# EasyEDA Pro project KOBE_FOC.epro, schematic KOBE_Doc_2
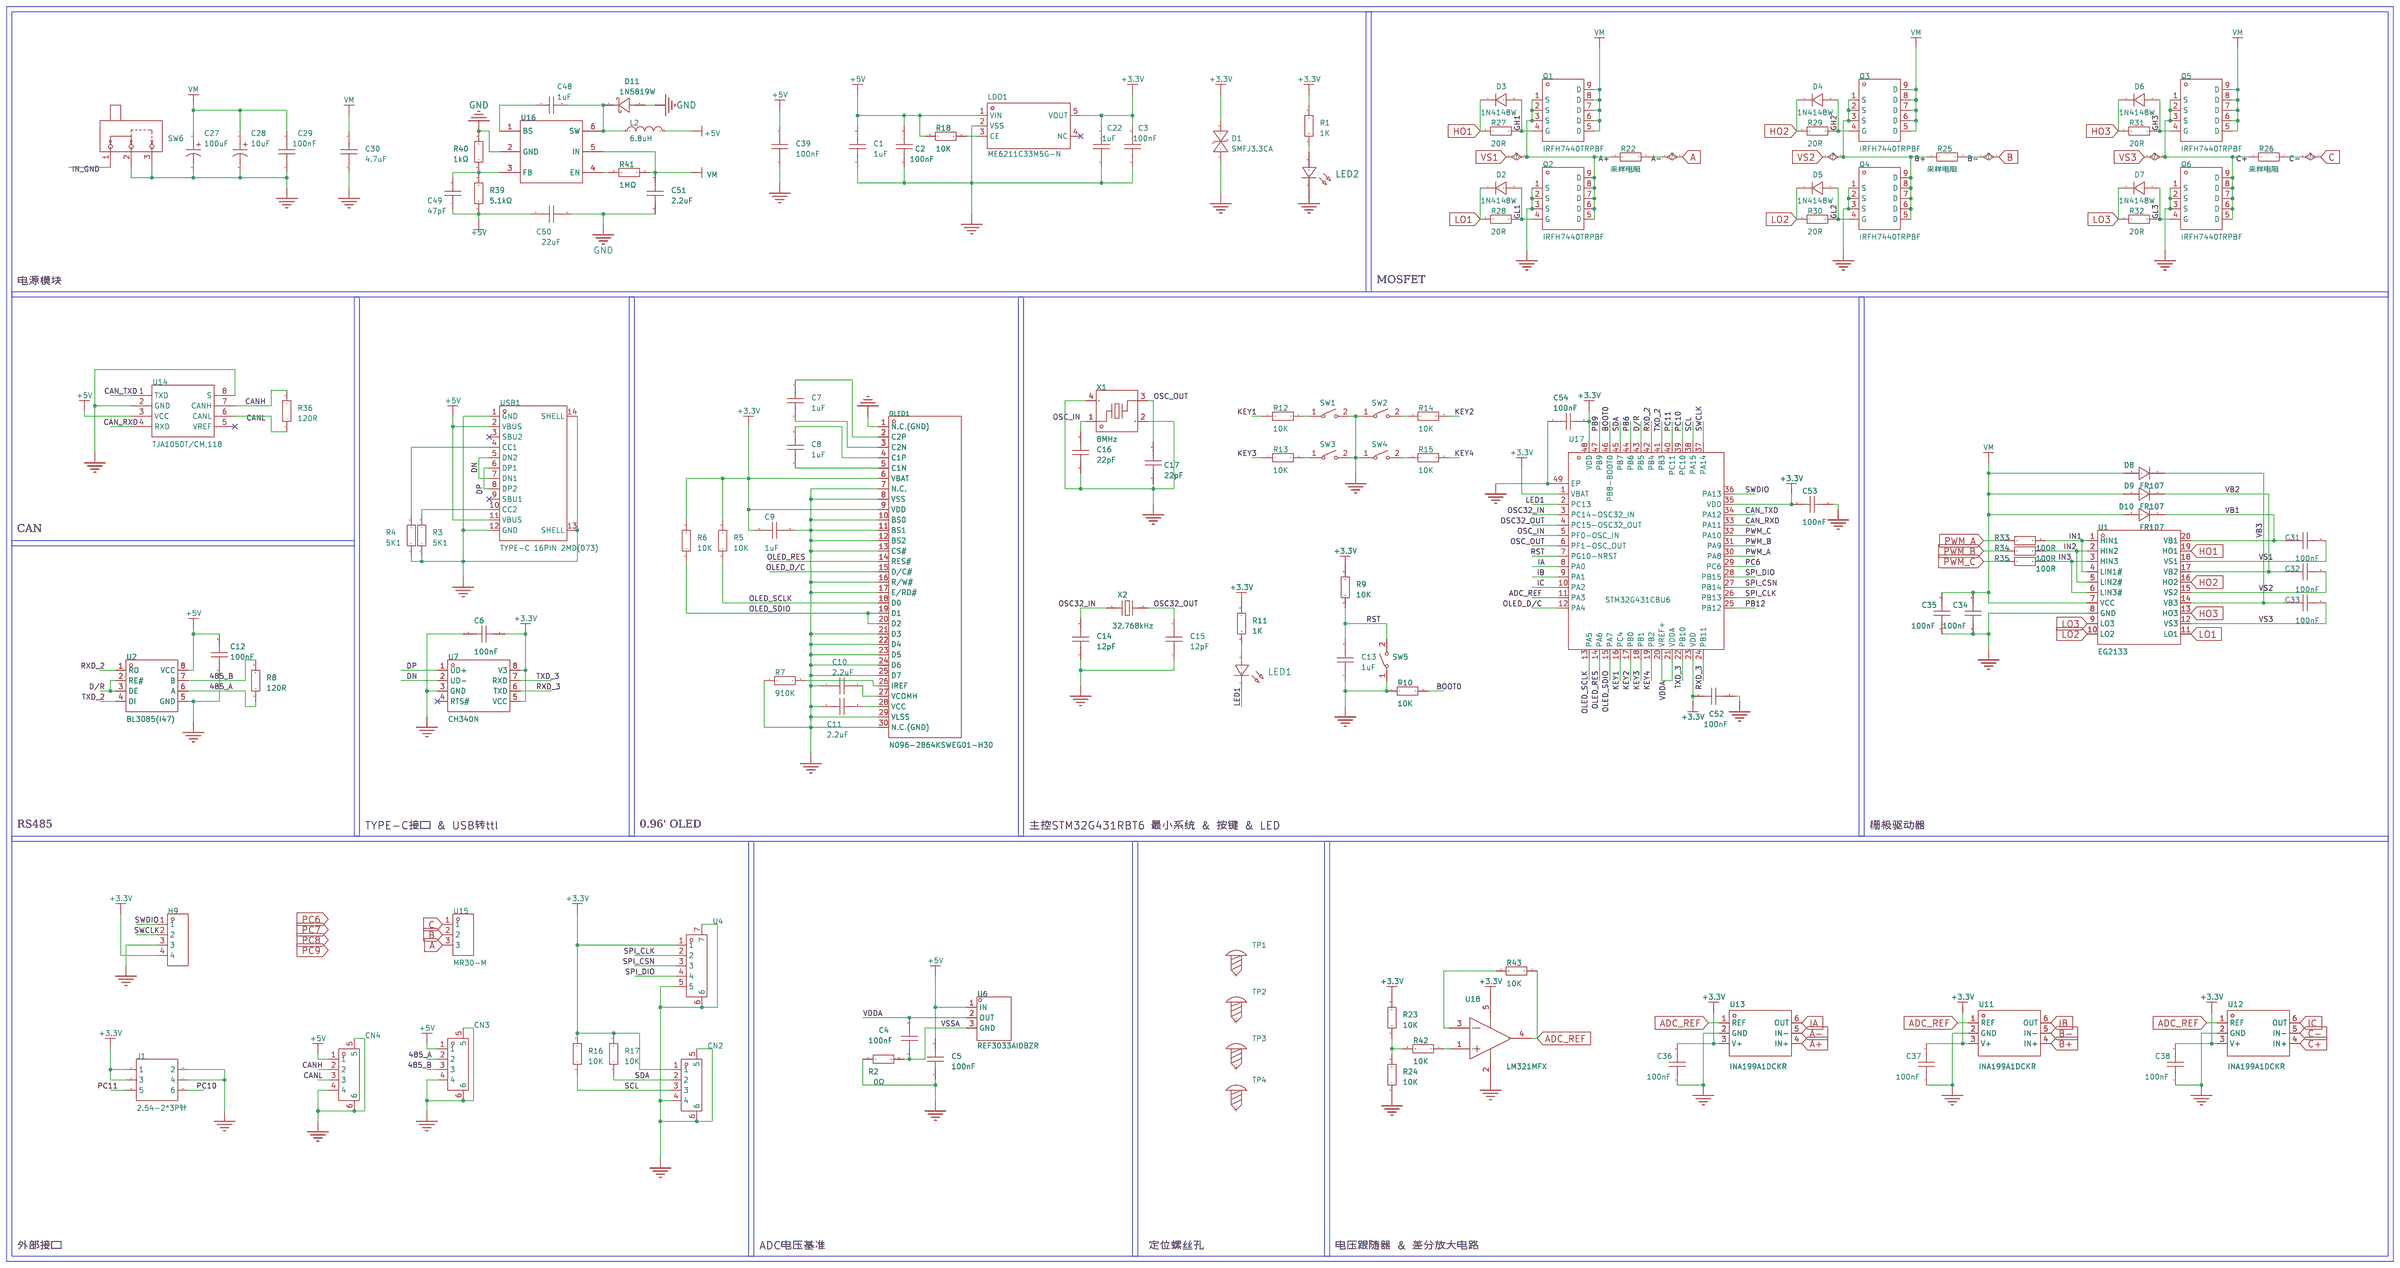
[diagram p0: schematic sheet]

## Parts
C1  1uF  [C0603]
C2  100nF  [C0603]
C3  100nF  [C0603]
C4  100nF  [C0603]
C5  100nF  [C0603]
C6  100nF  [C0603]
C7  1uF  [C0603]
C8  1uF  [C0603]
C9  1uF  [C0603]
C10  2.2uF  [C0603]
C11  2.2uF  [C0603]
C12  100nF  [C0603]
C13  1uF  [C0603]
C14  12pF  [C0603]
C15  12pF  [C0603]
C16  22pF  [C0603]
C17  22pF  [C0603]
C22  1uF  [C0603]
C27  100uF  [CAP-SMD_BD6.3-L6.6-W6.6-LS7.2-FD]
C28  10uF  [CAP-SMD_BD4.0-L4.3-W4.3-LS5.0-FD]
C29  100nF  [C0603]
C30  4.7uF  [C0603]
C31  100nF  [C0603]
C32  100nF  [C0603]
C33  100nF  [C0603]
C34  100nF  [C0603]
C35  100nF  [C0603]
C36  100nF  [C0603]
C37  100nF  [C0603]
C38  100nF  [C0603]
C39  100nF  [C0603]
C48  1uF  [C0603]
C49  47pF  [C0603]
C50  22uF  [C0603]
C51  2.2uF  [C0603]
C52  100nF  [C0603]
C53  100nF  [C0603]
C54  100nF  [C0603]
CN2  WAFER-SH1.0-4PWB  [CONN-SMD_4P-P1.00_WAFER-SH1.0-4PWB]
CN3  WAFER-SH1.0-4PWB  [CONN-SMD_4P-P1.00_WAFER-SH1.0-4PWB]
CN4  WAFER-SH1.0-4PWB  [CONN-SMD_4P-P1.00_WAFER-SH1.0-4PWB]
D1  SMFJ3.3CA  [SOD-123_L2.7-W1.6-LS3.7-BI]
D2  1N4148W  [SOD-123_L2.8-W1.8-LS3.7-RD]
D3  1N4148W  [SOD-123_L2.8-W1.8-LS3.7-RD]
D4  1N4148W  [SOD-123_L2.8-W1.8-LS3.7-RD]
D5  1N4148W  [SOD-123_L2.8-W1.8-LS3.7-RD]
D6  1N4148W  [SOD-123_L2.8-W1.8-LS3.7-RD]
D7  1N4148W  [SOD-123_L2.8-W1.8-LS3.7-RD]
D8  FR107  [SOD-123_L2.8-W1.8-LS3.7-RD]
D9  FR107  [SOD-123_L2.8-W1.8-LS3.7-RD]
D10  FR107  [SOD-123_L2.8-W1.8-LS3.7-RD]
D11  1N5819W  [SOD-123_L2.7-W1.6-LS3.7-RD-1]
H9  PZ254V-11-04P  [HDR-TH_4P-P2.54-V-M]
J1  2.54-2*3P针  [HDR-TH_6P-P2.54-V-M-R2-C3-S2.54-1]
L2  6.8uH  [IND-SMD_L4.4-W4.2]
LDO1  ME6211C33M5G-N  [SOT-23-5_L3.0-W1.7-P0.95-LS2.8-BL]
LED1  -  [LED_0603]
LED2  -  [LED_0603]
OLED1  N096-2864KSWEG01-H30  [OLED_0.96-30P-P0.70-12864]
Q1  IRFH7440TRPBF  [DFN-8_L5.8-W4.9-P1.27-LS6.0-BL-1]
Q2  IRFH7440TRPBF  [DFN-8_L5.8-W4.9-P1.27-LS6.0-BL-1]
Q3  IRFH7440TRPBF  [DFN-8_L5.8-W4.9-P1.27-LS6.0-BL-1]
Q4  IRFH7440TRPBF  [DFN-8_L5.8-W4.9-P1.27-LS6.0-BL-1]
Q5  IRFH7440TRPBF  [DFN-8_L5.8-W4.9-P1.27-LS6.0-BL-1]
Q6  IRFH7440TRPBF  [DFN-8_L5.8-W4.9-P1.27-LS6.0-BL-1]
R1  1K  [R0603]
R2  0Ω  [R0603]
R3  5K1  [R0603]
R4  5K1  [R0603]
R5  10K  [R0603]
R6  10K  [R0603]
R7  910K  [R0603]
R8  120R  [R0603]
R9  10K  [R0603]
R10  10K  [R0603]
R11  1K  [R0603]
R12  10K  [R0603]
R13  10K  [R0603]
R14  10K  [R0603]
R15  10K  [R0603]
R16  10K  [R0603]
R17  10K  [R0603]
R18  10K  [R0603]
R22  采样电阻  [R1206]
R23  10K  [R0603]
R24  10K  [R0603]
R25  采样电阻  [R1206]
R26  采样电阻  [R1206]
R27  20R  [R0603]
R28  20R  [R0603]
R29  20R  [R0603]
R30  20R  [R0603]
R31  20R  [R0603]
R32  20R  [R0603]
R33  100R  [R0603]
R34  100R  [R0603]
R35  100R  [R0603]
R36  120R  [R0603]
R39  5.1kΩ  [R0603]
R40  1kΩ  [R0603]
R41  1MΩ  [R0603]
R42  10K  [R0603]
R43  10K  [R0603]
SW1  TS-1088R-02026  [SW-SMD_L3.9-W3.0-P4.45]
SW2  TS-1088R-02026  [SW-SMD_L3.9-W3.0-P4.45]
SW3  TS-1088R-02026  [SW-SMD_L3.9-W3.0-P4.45]
SW4  TS-1088R-02026  [SW-SMD_L3.9-W3.0-P4.45]
SW5  TS-1088R-02026  [SW-SMD_L3.9-W3.0-P4.45]
SW6  KH-SS12D01-G3-5.0  [SW-TH_KH-SS12D01-G3-5.0]
TP1  -  [M2螺丝]
TP2  -  [M2螺丝]
TP3  -  [M2螺丝]
TP4  -  [M2螺丝]
U1  EG2133  [TSSOP-20_L6.5-W4.4-P0.65-LS6.4-BL]
U2  BL3085(I47)  [SOP-8_L4.9-W3.9-P1.27-LS6.0-BL]
U4  WAFER-SH1.0-5PWB  [CONN-SMD_5P-P1.00_XUNPU_WAFER-SH1.0-5PWB]
U6  REF3033AIDBZR  [SOT-23-3_L3.0-W1.7-P0.95-LS2.9-BR]
U7  CH340N  [SOP-8_L4.9-W3.9-P1.27-LS6.0-BL]
U11  INA199A1DCKR  [SC-70-6_L2.2-W1.3-P0.65-LS2.1-BR]
U12  INA199A1DCKR  [SC-70-6_L2.2-W1.3-P0.65-LS2.1-BR]
U13  INA199A1DCKR  [SC-70-6_L2.2-W1.3-P0.65-LS2.1-BR]
U14  TJA1050T/CM,118  [SOIC-8_L5.0-W4.0-P1.27-LS6.0-BL]
U15  MR30-M  [CONN-TH_MR30-M]
U16  ME3116AM6G  [SOT-23-6_L2.9-W1.6-P0.95-LS2.8-BL]
U17  STM32G431CBU6  [UFQFPN-48_L7.0-W7.0-P0.50-BL-EP]
U18  LM321MFX  [SOT-23-5_L2.9-W1.6-P0.95-LS2.8-BL]
USB1  TYPE-C 16PIN 2MD(073)  [USB-C-SMD_TYPE-C-6PIN-2MD-073]
X1  8MHz  [OSC-SMD_4P-L3.2-W2.5-BL]
X2  32.768kHz  [OSC-SMD_L3.2-W1.5]

## Library data of the parts
C1-C17 C22 C29-C39 C51-C54 = CAP_0603: Supplier Footprint: 0603
C27 = RVT100UF16V67RV0016: 容值:100uF;精度:±20%;额定电压:16V;纹波电流:93mA@120Hz;等效串联电阻:-;; LCSC Part Name: 100uF ±20% 16V; Supplier Part: C2887276; Manufacturer: KNSCHA(科尼盛); Supplier Footprint: SMD,D6.3xL5.4mm; JLCPCB Part Class: Extended Part; Datasheet: https://atta.szlcsc.com/upload/public/pdf/source/20210824/B97D2C1FD85DB1F31706138D89C4BE44.pdf; Supplier: LCSC; Tolerance: ±20%; Rated Voltage: 16V; Ripple Current: 93mA@120Hz; φD: 6.3mm; L: 5.4mm; Lifetime @ Temp: 2000hrs@105℃; Operating Temperature: -55℃~+105℃
C28 = VT10UF16V167RV0128: 容值:10uF;精度:±20%;额定电压:16V;纹波电流:18mA@120kHz;等效串联电阻:-;; LCSC Part Name: 10uF ±20% 16V; Supplier Part: C5246581; Manufacturer: KNSCHA(科尼盛); Supplier Footprint: SMD,D4xL5.4mm; JLCPCB Part Class: Extended Part; Datasheet: https://atta.szlcsc.com/upload/public/pdf/source/20221103/9F9BF07BB249386F3919A1DEC4ACBDCD.pdf; Supplier: LCSC; Tolerance: ±20%; Rated Voltage: 16V; Ripple Current: 18mA@120kHz; φD: 4mm; L: 5.4mm; Lifetime @ Temp: 2000hrs@105℃; Operating Temperature: -55℃~+105℃
C48 = 0603B103K500NT: 容值:10nF;精度:±10%;额定电压:50V;材质(温度系数):X7R;; LCSC Part Name: 10nF ±10% 50V; Supplier Part: C57112; Manufacturer: FH(风华); Supplier Footprint: 0603; JLCPCB Part Class: 基础库; Datasheet: https://atta.szlcsc.com/upload/public/pdf/source/20170923/C57112_1506149495135988846.pdf; Supplier: LCSC; Tolerance: ±10%; Voltage Rated: 50V; Temperature Coefficient: X7R
C49 = CL10C470JB8NNNC: 容值:47pF;精度:±5%;额定电压:50V;材质(温度系数):C0G;; LCSC Part Name: 47pF ±5% 50V; Supplier Part: C1671; Manufacturer: SAMSUNG(三星); Supplier Footprint: 0603; JLCPCB Part Class: 基础库; Datasheet: https://atta.szlcsc.com/upload/public/pdf/source/20160103/1457707689439.pdf; Supplier: LCSC; Tolerance: ±5%; Voltage Rated: 50V; Temperature Coefficient: C0G
C50 = CL10A226MQ8NRNC: 容值:22uF;精度:±20%;额定电压:6.3V;材质(温度系数):X5R;; LCSC Part Name: 22uF ±20% 6.3V; Supplier Part: C59461; Manufacturer: SAMSUNG(三星); Supplier Footprint: 0603; JLCPCB Part Class: 基础库; Datasheet: https://atta.szlcsc.com/upload/public/pdf/source/20160103/1457707740762.pdf; Supplier: LCSC; Tolerance: ±20%; Voltage Rated: 6.3V; Temperature Coefficient: X5R
CN2-CN4 = WAFER-SH1.0-4PWB: 插针结构:1x4P;间距:1mm;安装方式:卧贴;总PIN数:4P;排数:1;每排PIN数:4;额定电流:1A;工作温度范围:-25℃~+85℃;; LCSC Part Name: 1x4P 间距:1mm 卧贴; Supplier Part: C3029343; Manufacturer: XUNPU(讯普); Supplier Footprint: SMD,P=1mm,卧贴; JLCPCB Part Class: Extended Part; Datasheet: https://atta.szlcsc.com/upload/public/pdf/source/20220527/1879B8210BD3B2006BCEAC1A40D397B6.pdf; Supplier: LCSC; Pins Structure: 1x4P; Pitch: 1mm; Mounting Style: 卧贴; Number of Pins: 4P; Number of Rows: 1; Number of PINs Per Row: 4; Current Rating (Max): 1A; Operating Temperature Range: -25℃~+85℃
D1 = SMFJ3.3CA: SOD-123 200W  VRWM=3.3V 双向 功率TVS 电源口等; Supplier Part: C511919; Manufacturer: BORN(伯恩半导体); Supplier Footprint: SOD-123; JLCPCB Part Class: Extended Part; Datasheet: https://atta.szlcsc.com/upload/public/pdf/source/20220819/7A7ECAA22EB2D2C0D7168D96D0DEA0BB.pdf; Supplier: LCSC; Type: ESD
D2-D7 = 1N4148W_C2099: 二极管配置:独立式;正向压降(Vf):1.25V@150mA;直流反向耐压(Vr):100V;平均整流电流(Io):150mA;功率:500mW;反向恢复时间(trr):4ns;; LCSC Part Name: 电压:100V 电流:150mA; Supplier Part: C2099; Manufacturer: CJ(江苏长电/长晶); Supplier Footprint: SOD-123; JLCPCB Part Class: Extended Part; Datasheet: https://atta.szlcsc.com/upload/public/pdf/source/20120428/1457706480199.pdf; Supplier: LCSC; Diode Configuration: 独立式; Forward Voltage (Vf@If): 1.25V@150mA; Reverse Voltage (Vr): 100V; Average Rectified Current (Io): 150mA; Power Dissipation: 500mW; Reverse Leakage Current: 1uA@75V; Reverse Recovery Time (trr): 4ns
D8-D10 = FR107_C511885: 二极管配置:-;正向压降(Vf):1.3V@1A;直流反向耐压(Vr):1kV;平均整流电流(Io):1A;反向恢复时间(trr):500ns;; LCSC Part Name: 电压:1kV 电流:1A; Supplier Part: C511885; Manufacturer: BORN(伯恩半导体); Supplier Footprint: SOD-123; JLCPCB Part Class: Extended Part; Datasheet: https://atta.szlcsc.com/upload/public/pdf/source/20200413/C511885_F5BBF7A87475723E74BE0D118A106A7A.pdf; Supplier: LCSC; Forward Voltage (Vf@If): 1.3V@1A; Reverse Voltage (Vr): 1kV; Average Rectified Current (Io): 1A; Reverse Leakage Current: 5uA@1kV; Reverse Recovery Time (trr): 500ns; Operating Temperature: -55℃~+150℃@(Tj)
D11 = 1N5819W: 二极管配置:-;正向压降(Vf):900mV@3A;直流反向耐压(Vr):40V;平均整流电流(Io):1A;; LCSC Part Name: 电压:40V 电流:1A; Supplier Part: C2905650; Manufacturer: TECH PUBLIC(台舟); Supplier Footprint: SOD-123; JLCPCB Part Class: 扩展库; Datasheet: https://atta.szlcsc.com/upload/public/pdf/source/20211020/7FEA34DA99E5285CBA3CC87767B82BE7.pdf; Supplier: LCSC; Forward Voltage (Vf@If): 900mV@3A; Reverse Voltage (Vr): 40V; Average Rectified Current (Io): 1A; Reverse Leakage Current (Ir): 1mA@40V
H9 = PZ254V-11-04P: 插针结构:1x4P;间距:2.54mm;行距:-;圆针/方针:方针;安装类型:直插;排数:单排;总PIN位数:4P;额定电流:3A;额定电压:250V;配合针长度:6mm;塑高:2.5mm;端接针长度:3mm;触头材质:-;工作温度范围:-40℃~+105℃;颜色:黑色;; LCSC Part Name: 间距:2.54mm 1x4P 直插 方针; Supplier Part: C2691448; Manufacturer: XFCN(兴飞); Supplier Footprint: 插件,P=2.54mm; JLCPCB Part Class: Extended Part; Datasheet: https://atta.szlcsc.com/upload/public/pdf/source/20200309/C492403_F9F19131791D08044AD4F84F8E751A34.pdf; Supplier: LCSC; Pin Structure: 1x4P; Pitch: 2.54mm; Circluar Pins/Square Pins: 方针; Mounting Type: 直插; Number of Rows: 单排; Number of Pins: 4P; Current Rating (Max): 3A; Voltage Rating (Max): 250V; Length of Mating Pin: 6mm; Insulation Height: 2.5mm; Length of End Connection Pin: 3mm; Operating Temperature Range: -40℃~+105℃; Color: 黑色
J1 = 2.54-2*3P针: 插针结构:-;间距:2.54mm;行距:-;圆针/方针:-;安装类型:直插;排数:双排;总PIN位数:6P;额定电流:-;额定电压:-;配合针长度:-;塑高:-;触头材质:-;触头镀层:-;颜色:黑色;; LCSC Part Name: 间距:2.54mm 直插; Supplier Part: C65114; Manufacturer: BOOMELE(博穆精密); Supplier Footprint: 插件,P=2.54mm; JLCPCB Part Class: 扩展库; Supplier: LCSC; Pitch: 2.54mm; Mounting Type: 直插; Number of Rows: 双排; Number of Pins: 6P; Color: 黑色
L2 = FXL0420-6R8-M: 电感值:6.8uH;精度:±20%;额定电流:2.4A;饱和电流(Isat):2.5A;类型:一体成型电感;; LCSC Part Name: 6.8uH ±20% 2.5A; Supplier Part: C177241; Manufacturer: cjiang(长江微电); Supplier Footprint: SMD,4.2x4.4mm; JLCPCB Part Class: 扩展库; Datasheet: https://atta.szlcsc.com/upload/public/pdf/source/20240426/3189EA8206330E2108542F9E34E540E7.pdf; Supplier: LCSC; Tolerance: ±20%; Rated Current: 2.4A; Saturation Current (Isat): 2.5A; DC Resistance (DCR): 175mΩ; Type: 一体成型电感
LDO1 = ME6211C33M5G-N: 输出类型:固定;最大输入电压:6V;输出电压:3.3V;最大输出电流:500mA;电源纹波抑制比(PSRR):70dB;输出极性:正极;; LCSC Part Name: 输入6V 输出3.3V 500mA; Supplier Part: C82942; Manufacturer: MICRONE(南京微盟); Supplier Footprint: SOT-23-5; JLCPCB Part Class: Extended Part; Datasheet: https://atta.szlcsc.com/upload/public/pdf/source/20170918/C82942_1505727073070976520.pdf; Supplier: LCSC; Output Type: 固定; Maximum Input Voltage: 6V; Output Voltage: 3.3V; MAX Output Current: 500mA; Power Supply Rejection Ratio (PSRR): 70dB; Dropout Voltage: 260mV@(200mA); Output Polarity: 正极; Number of Outputs: 1
LED1 LED2 = LED_0603-R: Supplier Footprint: 0603
OLED1 = N096-2864KSWEG01-H30: 主控芯片:SSD1306;尺寸(inch):0.96;; LCSC Part Name: 0.96寸 白色 128x64像素分辨率 单色 30PIN; Supplier Part: C2890596; Manufacturer: Newvision(新智景); JLCPCB Part Class: Extended Part; Supplier: LCSC; Main Control Chip: SSD1306; Size: 0.96
Q1-Q6 = IRFH7440TRPBF: 类型:N沟道;漏源电压(Vdss):40V;连续漏极电流(Id):85A;功率(Pd):104W;导通电阻(RDS(on)@Vgs,Id):2.4mΩ@10V,50A;阈值电压(Vgs(th)@Id):3.9V@100uA;; LCSC Part Name: N沟道 耐压:40V 电流:85A; Supplier Part: C67862; Manufacturer: Infineon(英飞凌); Supplier Footprint: PQFN(5x6); JLCPCB Part Class: Extended Part; Datasheet: https://atta.szlcsc.com/upload/public/pdf/source/20190419/C386359_273C98C00830BF5419F9D4766EDDF693.pdf; Supplier: LCSC; Type: N沟道; Drain Source Voltage (Vdss): 40V; Continuous Drain Current (Id): 85A; Power Dissipation (Pd): 104W; Drain Source On Resistance (RDS(on)@Vgs,Id): 2.4mΩ@10V,50A; Gate Threshold Voltage (Vgs(th)@Id): 3.9V@100uA; Total Gate Charge (Qg@Vgs): 138nC@10V; Input Capacitance (Ciss@Vds): 4.574nF@25V; Operating Temperature: -55℃~+150℃@(Tj)
R1-R18 R23 R24 R27-R36 R42 R43 = Res_0603: Supplier Footprint: 0603
R22 R25 R26 = Res_1206: Supplier Footprint: 1206
R39 = RS-03K5101FT: 阻值:5.1kΩ;精度:±1%;功率:100mW;温度系数:±100ppm/℃;; LCSC Part Name: 5.1kΩ ±1% 100mW; Supplier Part: C156350; Manufacturer: FH(风华); Supplier Footprint: 0603; JLCPCB Part Class: 扩展库; Datasheet: https://atta.szlcsc.com/upload/public/pdf/source/20171221/C156350_15138396756901196077.pdf; Supplier: LCSC; Tolerance: ±1%; Power(Watts): 100mW; Temperature Coefficient: ±100ppm/℃; Overload Voltage (Max): 50V; Operating Temperature Range: -55℃~+155℃
R40 = 0603WAF1001T5E: 电阻类型:厚膜电阻;阻值:1kΩ;精度:±1%;功率:100mW;温度系数:±100ppm/℃;; LCSC Part Name: 厚膜电阻 1kΩ ±1% 100mW; Supplier Part: C21190; Manufacturer: UNI-ROYAL(厚声); Supplier Footprint: 0603; JLCPCB Part Class: 基础库; Datasheet: https://atta.szlcsc.com/upload/public/pdf/source/20200306/C422600_1E6D84923E4A46A82E41ADD87F860B5C.pdf; Supplier: LCSC; Type: 厚膜电阻; Tolerance: ±1%; Power(Watts): 100mW; Temperature Coefficient: ±100ppm/℃; Overload Voltage (Max): 75V; Operating Temperature Range: -55℃~+155℃
R41 = 0603WAF1004T5E: 电阻类型:厚膜电阻;阻值:1MΩ;精度:±1%;功率:100mW;; LCSC Part Name: 1MΩ ±1% 100mW; Supplier Part: C22935; Manufacturer: UNI-ROYAL(厚声); Supplier Footprint: 0603; JLCPCB Part Class: 基础库; Datasheet: https://atta.szlcsc.com/upload/public/pdf/source/20200306/C422600_1E6D84923E4A46A82E41ADD87F860B5C.pdf; Supplier: LCSC; Type: 厚膜电阻; Tolerance: ±1%; Power(Watts): 100mW; Temperature Coefficient: ±100ppm/℃; Overload Voltage (Max): 75V; Operating Temperature Range: -55℃~+155℃
SW1-SW5 = TS-1088R-02026: 电路结构:单刀单掷;按钮形状:圆形按钮;安装方式:立贴;开关长度:3.9mm;开关宽度:2.93mm;开关高度:2mm;触点电流:50mA;额定电压(DC):12V;带灯:-;机械寿命:-;; LCSC Part Name: 3.9*2.93*2mm 立贴 轻触开关; Supplier Part: C455280; Manufacturer: XUNPU(讯普); Supplier Footprint: SMD,3x4mm; JLCPCB Part Class: Extended Part; Datasheet: https://atta.szlcsc.com/upload/public/pdf/source/20191118/C455281_EC5379764BC1462550DF64BBBFEA9579.pdf; Supplier: LCSC; Circuit: 单刀单掷; Actuator Style: 圆形按钮; Mounting Style: 立贴; Switch Length: 3.9mm; Switch Width: 2.93mm; Switch Height: 2mm; Contact Current: 50mA; Voltage Rating (DC): 12V
SW6 = KH-SS12D01-G3-5.0: LCSC Part Name: 拨动开关 KH-SS12D01-G3-5.0针(SS12D00); Supplier Part: C5274456; Manufacturer: kinghelm(金航标); Supplier Footprint: 插件; JLCPCB Part Class: Extended Part; Datasheet: https://atta.szlcsc.com/upload/public/pdf/source/20221118/89F8282F9CF9F25DF0FDDB8FDD97EC5C.pdf; Supplier: LCSC
TP1-TP4 = M2螺丝: Supplier Footprint: 插件
U1 = EG2133_C190343: EG2133是一款高性价比的三相半桥驱动芯片，配合六颗Nmos可以组成三相直流无刷电机驱动器。; Supplier Part: C190343; Manufacturer: EG(屹晶微); Supplier Footprint: TSSOP-20; JLCPCB Part Class: Extended Part; Datasheet: https://atta.szlcsc.com/upload/public/pdf/source/20220627/F8A393EEBF3325F22DCB485BC683267F.pdf; Supplier: LCSC
U2 = BL3085(I47): 可替换BL3085(I37); Supplier Part: C2960453; Manufacturer: BL(上海贝岭); Supplier Footprint: SOP-8; JLCPCB Part Class: Extended Part; Datasheet: https://atta.szlcsc.com/upload/public/pdf/source/20231123/B180DC85E1E729469BC3FB302A7AB719.pdf; Supplier: LCSC
U4 = WAFER-SH1.0-5PWB: 插针结构:1x5P;间距:1mm;安装方式:卧贴;总PIN数:5P;排数:1;每排PIN数:5;额定电流:1A;工作温度范围:-25℃~+85℃;; LCSC Part Name: 1x5P 间距:1mm 卧贴; Supplier Part: C3029344; Manufacturer: XUNPU(讯普); Supplier Footprint: SMD,P=1mm,卧贴; JLCPCB Part Class: Extended Part; Datasheet: https://atta.szlcsc.com/upload/public/pdf/source/20220527/1879B8210BD3B2006BCEAC1A40D397B6.pdf; Supplier: LCSC; Pins Structure: 1x5P; Pitch: 1mm; Mounting Style: 卧贴; Number of Pins: 5P; Number of Rows: 1; Number of PINs Per Row: 5; Current Rating (Max): 1A; Operating Temperature Range: -25℃~+85℃
U6 = REF3033AIDBZR: 输出类型:固定;输入电压:3.35V~5.5V;输出电压:3.3V;输出电流:25mA;精度:±0.2%;; Supplier Part: C36658; Manufacturer: TI(德州仪器); Supplier Footprint: SOT-23; JLCPCB Part Class: Extended Part; Datasheet: https://www.ti.com/cn/lit/gpn/ref3020; Supplier: LCSC; Output Type: 固定; Input Voltage: 3.35V~5.5V; Output Voltage: 3.3V; Output Current: 25mA; Tolerance: ±0.2%; Temperature Coefficient: 75ppm/℃; Reference Type: 串联; Supply Current: 50uA; Noise - 10Hz to 10kHz: 105uVrms; Operating Temperature: -40℃~+125℃@(Ta)
U7 = CH340N: LCSC Part Name: USB转串口芯片 CH340; Supplier Part: C2977777; Manufacturer: WCH(南京沁恒); Supplier Footprint: SOP-8; JLCPCB Part Class: Extended Part; Datasheet: https://atta.szlcsc.com/upload/public/pdf/source/20230530/6E401E9554E9F5311886CC8B3F89B62E.pdf; Supplier: LCSC
U11-U13 = INA199A1DCKR: INA199 26V、双向电流感应放大器; Supplier Part: C59135; Manufacturer: TI(德州仪器); Supplier Footprint: SOT-363(SC-70-6); JLCPCB Part Class: Extended Part; Datasheet: https://www.ti.com/cn/lit/gpn/ina199; Supplier: LCSC; Supply Voltage: -300mV~26V; Supply Current: 300uA; Operating Temperature: -40℃~+125℃
U14 = TJA1050T/CM,118: 类型:收发器;; LCSC Part Name: 4.75V~5.25V; Supplier Part: C6952; Manufacturer: NXP(恩智浦); Supplier Footprint: SOP-8; JLCPCB Part Class: 扩展库; Datasheet: https://atta.szlcsc.com/upload/public/pdf/source/20140411/1457707042917.pdf; Supplier: LCSC; Type: 收发器; Supply Voltage: 4.75V~5.25V; Supply Current: 50mA
U15 = MR30-M: 类别:-;类型1:-;; LCSC Part Name: AMASS(艾迈斯)锂电池三芯电源连接器公头MR30-M 2件套; Supplier Part: C99873; Manufacturer: AMASS(艾迈斯); JLCPCB Part Class: 扩展库; Datasheet: https://atta.szlcsc.com/upload/public/pdf/source/20170412/1491969315720.pdf; Supplier: LCSC; Brand: 艾迈斯; Type: 航空插头; InterfaceType: 公头; specifications: 3pin
U16 = ME3116AM6G_C97643: 功能类型:降压型;同步整流:-;输出通道数:-;拓扑结构:-;输入电压:-;输出电流(最大值):-;开关频率:-;; LCSC Part Name: 降压型; Supplier Part: C97643; Manufacturer: MICRONE(南京微盟); Supplier Footprint: SOT-23-6; JLCPCB Part Class: 扩展库; Datasheet: https://atta.szlcsc.com/upload/public/pdf/source/20170322/1490151692992.pdf; Supplier: LCSC; Function: 降压型
U17 = STM32G431CBU6: CPU内核:-;程序存储容量:128KB;RAM总容量:32KB;GPIO端口数量:42;工作电压范围:1.71V~3.6V;CPU最大主频:170MHz;程序存储器类型:FLASH;; LCSC Part Name: 带DSP和FPU的170MHz主流ARM Cortex-M4 MCU，具有128 KB Flash存储器、数学加速器和中等模拟电平集成; Supplier Part: C529356; Manufacturer: ST(意法半导体); Supplier Footprint: UFQFPN-48(7x7); JLCPCB Part Class: 扩展库; Datasheet: https://atta.szlcsc.com/upload/public/pdf/source/20200511/C529354_7C66CF00837B904D0C15DCE45B69418C.pdf; Supplier: LCSC; Program Storage Size: 128KB; RAM Size: 32KB; GPIO Ports Number: 42; Operating Voltage Range: 1.71V~3.6V; CPU Maximum Speed: 170MHz; Program Memory Type: FLASH; Operating Temperature Range: -40℃~+85℃; ADC (Bit): 12bit; DAC (Bit): 12bit; Peripheral/Function: DMA；PWM; Watchdog: 有; Infrared Data Association: 有; Low-Voltage Detect: 有; Direct Memory Access: 有; Internal Oscillator: 有
U18 = LM321MFX: Supplier Part: C3011196; Manufacturer: TECH PUBLIC(台舟); Supplier Footprint: SOT-23-5; JLCPCB Part Class: 扩展库; Datasheet: https://atta.szlcsc.com/upload/public/pdf/source/20220509/03200087432F7B4F14C604FB62263FDD.pdf; Supplier: LCSC
USB1 = TYPE-C 16PIN 2MD(073): 连接器类型:Type-C;标准:-;公母:母;端口数量:1;触点数量:16P;安装方式:卧贴;额定电流 - 电源:5A;工作温度范围:-25℃~+85℃;; LCSC Part Name: Type-C 母 卧贴; Supplier Part: C2765186; Manufacturer: SHOU HAN(首韩); Supplier Footprint: SMD; JLCPCB Part Class: Extended Part; Datasheet: https://atta.szlcsc.com/upload/public/pdf/source/20211123/39B17C16241EAC15C5E277BDA434118E.pdf; Supplier: LCSC; Connector Type: Type-C; Gender: 母; Number of Ports: 1; Number of Contacts: 16P; Mounting Style: 卧贴; Current Rating - Power (Max): 5A; Operating Temperature Range: -25℃~+85℃
X1 = X32258MOB4SI: 晶振类型:贴片晶振;频率:8MHz;常温频差:±10ppm;外接负载电容:12pF;频率稳定度(全温):±20ppm;; LCSC Part Name: 8MHz ±10ppm 12pF; Supplier Part: C2682775; Manufacturer: YXC(扬兴晶振); Supplier Footprint: SMD3225-4P; JLCPCB Part Class: Extended Part; Datasheet: https://atta.szlcsc.com/upload/public/pdf/source/20240329/19D5F850207469550BEB00D7DFEDBC7A.pdf; Supplier: LCSC; Crystal Type: 贴片晶振; Normal temperature Frequency Tolerance: ±10ppm; External load capacitor: 12pF; Frequency Stability(Full temperature range): ±20ppm; Equivalent Series Resistance (ESR): 150Ω; Operating Temperature: -40℃~+85℃
X2 = X321532768KGD2SI: 晶振类型:贴片晶振;频率:32.768kHz;常温频差:±20ppm;外接负载电容:12.5pF;频率稳定度(全温):-;; LCSC Part Name: 32.768kHz ±20ppm 12.5pF; Supplier Part: C620155; Manufacturer: YXC(扬兴晶振); Supplier Footprint: SMD3215-2P; JLCPCB Part Class: Extended Part; Datasheet: https://atta.szlcsc.com/upload/public/pdf/source/20240329/3A7650FD985DD0DE85694D3785AB4916.pdf; Supplier: LCSC; Crystal Type: 贴片晶振; Normal temperature Frequency Tolerance: ±20ppm; External load capacitor: 12.5pF; Operating Temperature: -40℃~+85℃

## Nets
1V65: R23.1 R24.2 R42.2
+3.3V: C3.2 C6.2 C9.1 C22.2 C36.2 C37.2 C38.2 C52.1 C53.1 C54.2 CN2.1 D1.2 H9.4 J1.1 J1.3 LDO1.5(VOUT) OLED1.6(VBAT) OLED1.9(VDD) R1.1 R5.2 R6.2 R9.2 R11.1 R16.2 R17.2 R23.2 U4.1 U7.5(VCC) U7.8(V3) U11.3(V+) U12.3(V+) U13.3(V+) U17.1(VBAT) U17.23(VDD) U17.35(VDD) U17.48(VDD) U18.5(+VS)
+5V: C1.2 C2.2 C5.2 C12.2 C39.2 C49.1 C50.1 CN3.1 CN4.1 L2.2 LDO1.1(VIN) R18.1 R39.1 U2.8(VCC) U6.1(IN) U14.3(VCC) USB1.2(VBUS) USB1.11(VBUS)
GND: C1.1 C2.1 C3.1 C5.1 C6.1 C9.2 C10.1 C11.1 C12.1 C13.1 C14.1 C15.1 C16.1 C17.1 C22.1 C27.2 C28.2 C29.1 C30.1 C34.1 C35.1 C36.1 C37.1 C38.1 C39.1 C50.2 C51.1 C52.2 C53.2 C54.1 CN2.4 CN2.5 CN2.6 CN3.4 CN3.5 CN3.6 CN4.4 CN4.5 CN4.6 D1.1 D11.2(A) H9.3 J1.2 J1.4 LDO1.2(VSS) LED2.1(C) OLED1.1(N.C.(GND)) OLED1.7(N.C.) OLED1.8(VSS) OLED1.10(BS0) OLED1.11(BS1) OLED1.12(BS2) OLED1.13(CS#) OLED1.16(R/W#) OLED1.17(E/RD#) OLED1.21(D3) OLED1.22(D4) OLED1.23(D5) OLED1.24(D6) OLED1.25(D7) OLED1.29(VLSS) OLED1.30(N.C.(GND)) Q2.1(S) Q2.2(S) Q2.3(S) Q4.1(S) Q4.2(S) Q4.3(S) Q6.1(S) Q6.2(S) Q6.3(S) R2.1 R3.1 R4.1 R7.1 R10.1 R24.1 R40.1 SW1.2 SW2.1 SW3.2 SW4.1 SW5.1 SW6.2 SW6.3 U1.8(GND) U2.5(GND) U4.5 U4.6 U4.7 U7.3(GND) U11.2(GND) U12.2(GND) U13.2(GND) U14.2(GND) U14.8(S) U16.2(GND) U17.49(EP) U18.2(-VS) USB1.1(GND) USB1.12(GND) USB1.13(SHELL) USB1.14(SHELL) X1.2(GND) X1.4(GND)
VDDA: C4.2 U6.2(OUT) U17.20(VREF+) U17.21(VDDA)
VSSA: C4.1 R2.2 U6.3(GND)
485_A: CN3.2 R8.1 U2.6(A)
485_B: CN3.3 R8.2 U2.7(B)
A: R22.2 U13.5(IN-) U15.3
A+: C31.2 Q1.1(S) Q1.2(S) Q1.3(S) Q2.5(D) Q2.6(D) Q2.7(D) Q2.8(D) Q2.9(D) R22.1 U1.18(VS1) U13.4(IN+)
ADC_REF: R43.1 U11.1(REF) U12.1(REF) U13.1(REF) U17.11(PA3) U18.4(OUT)
B: R25.2 U11.5(IN-) U15.2
B+: C32.2 Q3.1(S) Q3.2(S) Q3.3(S) Q4.5(D) Q4.6(D) Q4.7(D) Q4.8(D) Q4.9(D) R25.1 U1.15(VS2) U11.4(IN+)
BOOT0: R10.2 U17.46(PB8-BOOT0)
BS: C48.1 U16.1(BS)
C: R26.2 U12.5(IN-) U15.1
C1N: C8.1 OLED1.5(C1N)
C1P: C8.2 OLED1.4(C1P)
C2N: C7.1 OLED1.3(C2N)
C2P: C7.2 OLED1.2(C2P)
C+: C33.2 Q5.1(S) Q5.2(S) Q5.3(S) Q6.5(D) Q6.6(D) Q6.7(D) Q6.8(D) Q6.9(D) R26.1 U1.12(VS3) U12.4(IN+)
CAN_RXD: U14.4(RXD) U17.33(PA11)
CAN_TXD: U14.1(TXD) U17.34(PA12)
CANH: CN4.2 R36.2 U14.7(CANH)
CANL: CN4.3 R36.1 U14.6(CANL)
CC1: R4.2 USB1.4(CC1)
CC2: R3.2 USB1.10(CC2)
CE: LDO1.3(CE) R18.2
D/R: U2.2(RE#) U2.3(DE) U17.43(PB5)
DCEN: R41.2 U16.4(EN)
DCFB: C49.2 R39.2 R40.2 U16.3(FB)
DN: U7.2(UD-) USB1.5(DN2) USB1.7(DN1)
DP: U7.1(UD+) USB1.6(DP1) USB1.8(DP2)
GH1: D3.2(A) Q1.4(G) R27.2
GH2: D4.2(A) Q3.4(G) R29.2
GH3: D6.2(A) Q5.4(G) R31.2
GL1: D2.2(A) Q2.4(G) R28.2
GL2: D5.2(A) Q4.4(G) R30.2
GL3: D7.2(A) Q6.4(G) R32.2
HO1: D3.1(K) R27.1 U1.19(HO1)
HO2: D4.1(K) R29.1 U1.16(HO2)
HO3: D6.1(K) R31.1 U1.13(HO3)
IA: U13.6(OUT) U17.8(PA0)
IB: U11.6(OUT) U17.9(PA1)
IC: U12.6(OUT) U17.10(PA2)
IN1: R33.2 U1.1(HIN1) U1.4(LIN1#)
IN2: R34.2 U1.2(HIN2) U1.5(LIN2#)
IN3: R35.2 U1.3(HIN3) U1.6(LIN3#)
IN_GND: SW6.1
K1: R12.2 SW1.1
K2: R14.1 SW2.2
K3: R13.2 SW3.1
K4: R15.1 SW4.2
KEY1: R12.1 U17.16(PC4)
KEY2: R14.2 U17.17(PB0)
KEY3: R13.1 U17.18(PB1)
KEY4: R15.2 U17.19(PB2)
LD1: LED1.2(A) R11.2
LD2: LED2.2(A) R1.2
LED1: LED1.1(C) U17.2(PC13)
LM+: R42.1 U18.1(+IN)
LM-: R43.2 U18.3(-IN)
LO1: D2.1(K) R28.1 U1.11(LO1)
LO2: D5.1(K) R30.1 U1.10(LO2)
LO3: D7.1(K) R32.1 U1.9(LO3)
OIREF: OLED1.26(IREF) R7.2
OLED_D/C: OLED1.15(D/C#) U17.12(PA4)
OLED_RES: OLED1.14(RES#) U17.14(PA6)
OLED_SCLK: OLED1.18(D0) R5.1 U17.13(PA5)
OLED_SDIO: OLED1.19(D1) OLED1.20(D2) R6.1 U17.15(PA7)
OSC32_IN: C14.2 U17.3(PC14-OSC32_IN) X2.1
OSC32_OUT: C15.2 U17.4(PC15-OSC32_OUT) X2.2
OSC_IN: C16.2 U17.5(PF0-OSC_IN) X1.1
OSC_OUT: C17.2 U17.6(PF1-OSC_OUT) X1.3
OVC: C11.2 OLED1.28(VCC)
PB6: U17.44(PB6)
PB9: U17.47(PB9)
PB12: U17.25(PB12)
PC6: U17.29(PC6)
PC10: J1.6 U17.39(PC10)
PC11: J1.5 U17.40(PC11)
PWM_A: R33.1 U17.30(PA8)
PWM_B: R34.1 U17.31(PA9)
PWM_C: R35.1 U17.32(PA10)
RST: C13.2 R9.1 SW5.2 U17.7(PG10-NRST)
RXD_2: U2.1(RO) U17.42(PB4)
RXD_3: U7.6(TXD) U17.24(PB11)
SCL: CN2.3 R16.1 U17.38(PA15)
SDA: CN2.2 R17.1 U17.45(PB7)
SPI_CLK: U4.2 U17.26(PB13)
SPI_CSN: U4.3 U17.27(PB14)
SPI_DIO: U4.4 U17.28(PB15)
SW: C48.2 D11.1(K) L2.1 U16.6(SW)
SWCLK: H9.2 U17.37(PA14)
SWDIO: H9.1 U17.36(PA13)
TXD_2: U2.4(DI) U17.41(PB3)
TXD_3: U7.7(RXD) U17.22(PB10)
VB1: C31.1 D10.1(K) U1.20(VB1)
VB2: C32.1 D9.1(K) U1.17(VB2)
VB3: C33.1 D8.1(K) U1.14(VB3)
VCOMH: C10.2 OLED1.27(VCOMH)
VM: C27.1 C28.1 C29.2 C30.2 C34.2 C35.2 C51.2 D8.2(A) D9.2(A) D10.2(A) Q1.5(D) Q1.6(D) Q1.7(D) Q1.8(D) Q1.9(D) Q3.5(D) Q3.6(D) Q3.7(D) Q3.8(D) Q3.9(D) Q5.5(D) Q5.6(D) Q5.7(D) Q5.8(D) Q5.9(D) R41.1 U1.7(VCC) U16.5(IN)

Not connected (* = marked no-connect by the designer): LDO1 4(NC)*; TP1 1; TP2 1; TP3 1; TP4 1; U7 4(RTS#)*; U14 5(VREF)*; USB1 3(SBU2)* 9(SBU1)*

## Notes on the sheet
- 电源模块
- MOSFET
- CAN
- RS485
- TYPE-C接口 & USB转ttl
- 0.96' OLED
- 主控STM32G431RBT6 最小系统 & 按键 & LED
- 栅极驱动器
- 外部接口
- ADC电压基准
- 定位螺丝孔
- 电压跟随器 & 差分放大电路
